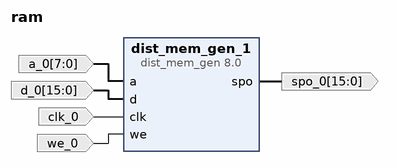
[diagram p0: block diagram of the top level]
# Vivado block design ram, xc7a100tcsg324-1, Vivado 2018.2
create_bd_design ram

create_bd_port -dir O -from 15 -to 0 spo_0
create_bd_port -dir I -from 7 -to 0 a_0
create_bd_port -dir I -from 15 -to 0 d_0
create_bd_port -dir I clk_0
create_bd_port -dir I we_0

create_bd_cell -type ip -vlnv xilinx.com:ip:dist_mem_gen:8.0 dist_mem_gen_1
set_property -dict {CONFIG.depth 256 CONFIG.coefficient_file ../../../../../../task1.coe} [get_bd_cells dist_mem_gen_1]

# ---- connections ----

connect_bd_net [get_bd_pins dist_mem_gen_1/spo] [get_bd_ports spo_0]
connect_bd_net -net a_0_1 [get_bd_ports a_0] [get_bd_pins dist_mem_gen_1/a]
connect_bd_net -net d_0_1 [get_bd_ports d_0] [get_bd_pins dist_mem_gen_1/d]
connect_bd_net -net clk_0_1 [get_bd_ports clk_0] [get_bd_pins dist_mem_gen_1/clk]
connect_bd_net -net we_0_1 [get_bd_ports we_0] [get_bd_pins dist_mem_gen_1/we]

validate_bd_design
save_bd_design
